# EAGLE design HeadphoneAmplifierUsingLM386 (EAGLE 9.6.2)
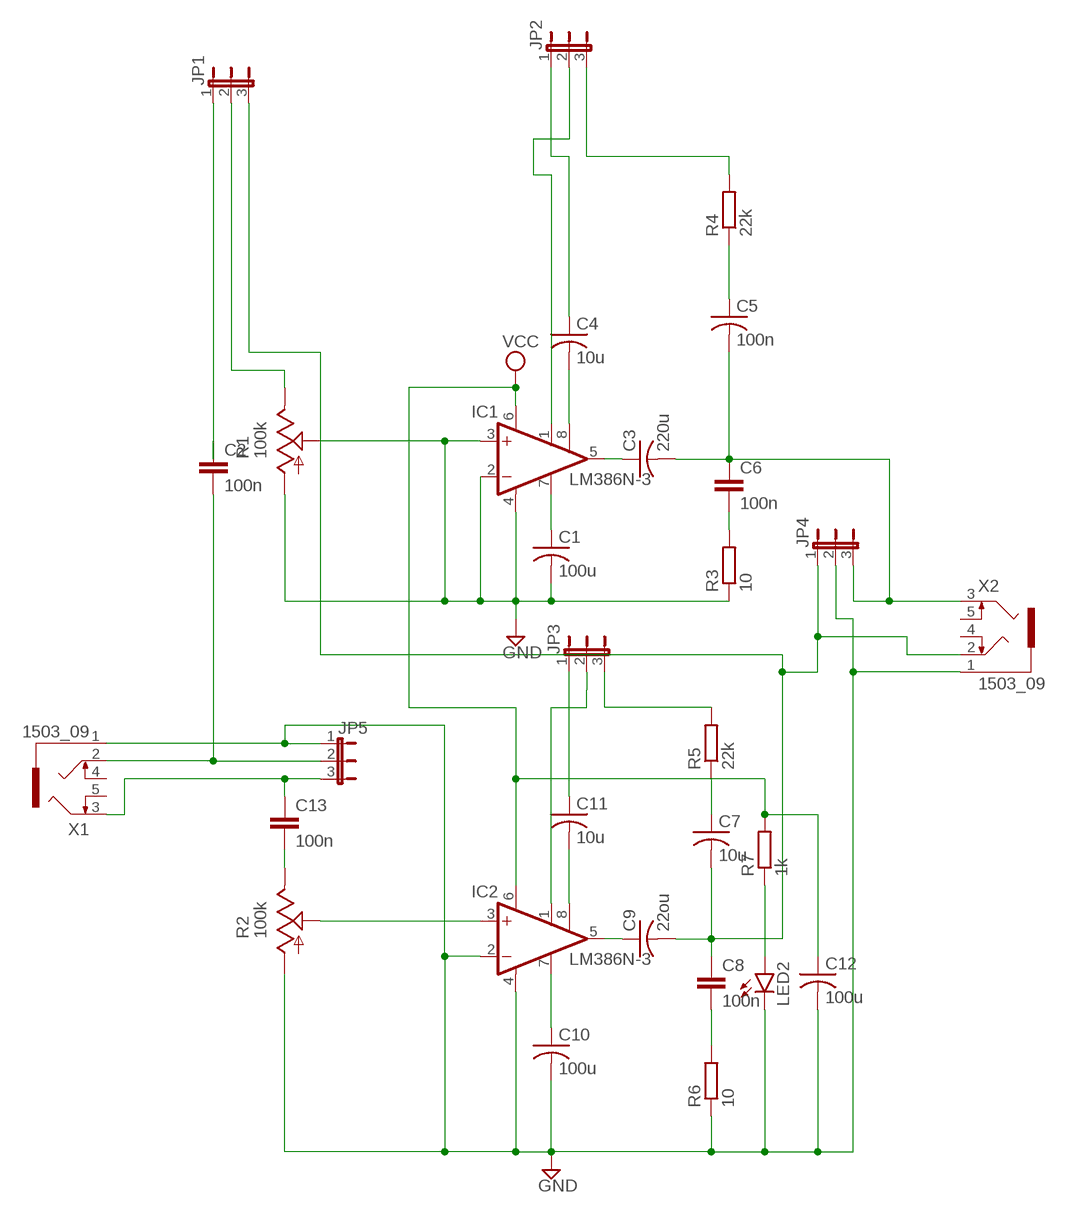
[diagram p0: schematic, sheet 1]

## Parts
C1  100u  C-US025-030X050  [C025-030X050]
C2  100n  C-EU025-030X050  [C025-030X050]
C3  220u  C-US025-030X050  [C025-030X050]
C4  10u  C-US025-030X050  [C025-030X050]
C5  100n  C-US025-030X050  [C025-030X050]
C6  100n  C-EU025-030X050  [C025-030X050]
C7  10u  C-US025-030X050  [C025-030X050]
C8  100n  C-EU025-030X050  [C025-030X050]
C9  22ou  C-US025-030X050  [C025-030X050]
C10  100u  C-US025-030X050  [C025-030X050]
C11  10u  C-US025-030X050  [C025-030X050]
C12  100u  C-US025-030X050  [C025-030X050]
C13  100n  C-EU025-030X050  [C025-030X050]
IC1  LM386N-3  [DIL08]
IC2  LM386N-3  [DIL08]
JP1  JP2E  [JP2]
JP2  JP2E  [JP2]
JP3  JP2E  [JP2]
JP4  JP2E  [JP2]
JP5  JP2E  [JP2]
LED2  LED3MM  [LED3MM]
R1  100k  TRIM_US-3223W  [3223W]
R2  100k  TRIM_US-3223W  [3223W]
R3  10  R-EU_0309/12  [0309/12]
R4  22k  R-EU_0309/12  [0309/12]
R5  22k  R-EU_0309/12  [0309/12]
R6  10  R-EU_0309/12  [0309/12]
R7  1k  R-EU_0309/12  [0309/12]
X1  1503_09  [1503_09]
X2  1503_09  [1503_09]

## Nets
GND: C1.2 C10.2 C12.2 IC1.2(-IN) IC1.3(+IN) IC1.4(GND) IC2.2(-IN) IC2.4(GND) JP4.2 JP5.1 LED2.K(C) R1.1(A) R1.2(S) R2.1(A) R3.1 R6.1 X1.1 X2.1
N$1: C2.1 JP1.1
N$2: C4.2 IC1.8(GAIN)
N$3: IC2.3(+IN) R2.2(S)
N$4: C1.1 IC1.7(BYPASS)
N$5: C3.1 IC1.5(OUT)
N$6: C3.2 C5.2 C6.1 JP4.3 X2.3
N$7: C2.2 JP5.2 X1.2
N$8: IC1.1(GAIN) JP2.2
N$9: C6.2 R3.2
N$10: C7.2 C8.1 C9.2 JP1.3 JP4.1 X2.2
N$11: C5.1 R4.1
N$12: C7.1 R5.1
N$13: JP2.3 R4.2
N$14: C8.2 R6.2
N$15: C10.1 IC2.7(BYPASS)
N$16: JP3.3 R5.2
N$17: C9.1 IC2.5(OUT)
N$18: C11.2 IC2.8(GAIN)
N$19: IC2.1(GAIN) JP3.2
N$20: C11.1 JP3.1
N$21: LED2.A R7.1
N$22: JP1.2 R1.3(E)
N$23: C13.2 R2.3(E)
N$24: C13.1 JP5.3 X1.3
N$25: C4.1 JP2.1
VCC: C12.1 IC1.6(VS) IC2.6(VS) R7.2
Unconnected: X1.4 X1.5 X2.4 X2.5

## Library data of the parts
C1 C3-C5 C7 C9-C12 = rcl:C-US: CAPACITOR, American symbol; SPICEPREFIX: C
C2 C6 C8 C13 = rcl:C-EU: CAPACITOR, European symbol; SPICEPREFIX: C
IC1 IC2 = linear:LM386?-*: Low Voltage Audio Power Amplifier Source: http://cache.national.com/ds/LM/LM386.pdf
JP1-JP5 = jumper:JP2E: JUMPER
LED2 = led:LED: LED OSRAM: - CHIPLED LG R971, LG N971, LY N971, LG Q971, LY Q971, LO R971, LY R971 LH N974, LH R974 LS Q976, LO Q976, LY Q976 LO Q996 - Hyper CHIPLED LW Q18S LB Q993, LB Q99A, LB R99A - SideLED LS A670, LO A670, LY A670, LG A670, LP A670 LB A673, LV A673, LT A673, LW A673 LH A674 LY A675 LS A676, LA A676, LO A676, LY A676, LW A676 LS A679, LY A679, LG A679 - Hyper Micro SIDELED® LS Y876, LA Y876, LO Y876, LY Y876 LT Y87S - SmartLED LW L88C, LW L88S LB L89C, LB L89S, LG L890 LS L89K, LO L89K, LY L89K LS L896, LA L896, LO L896, LY L896 - TOPLED LS T670, LO T670, LY T670, LG T670, LP T670 LSG T670, LSP T670, LSY T670, LOP T670, LYG T670 LG T671, LOG T671, LSG T671 LB T673, LV T673, LT T673, LW T673 LH T674 LS T676, LA T676, LO T676, LY T676, LB T676, LH T676, LSB T676, LW T676 LB T67C, LV T67C, LT T67C, LS T67K, LO T67K, LY T67K, LW E67C LS E67B, LA E67B, LO E67B, LY E67B, LB E67C, LV E67C, LT E67C LW T67C LS T679, LY T679, LG T679 LS T770, LO T770, LY T770, LG T770, LP T770 LB T773, LV T773, LT T773, LW T773 LH T774 LS E675, LA E675, LY E675, LS T675 LS T776, LA T776, LO T776, LY T776, LB T776 LHGB T686 LT T68C, LB T68C - Hyper Mini TOPLED® LB M676 - Mini TOPLED Santana® LG M470 LS M47K, LO M47K, LY M47K Source: http://www.osram.convergy.de LUXEON: - LUMILED® LXK2-PW12-R00, LXK2-PW12-S00, LXK2-PW14-U00, LXK2-PW14-V00 LXK2-PM12-R00, LXK2-PM12-S00, LXK2-PM14-U00 LXK2-PE12-Q00, LXK2-PE12-R00, LXK2-PE12-S00, LXK2-PE14-T00, LXK2-PE14-U00 LXK2-PB12-K00, LXK2-PB12-L00, LXK2-PB12-M00, LXK2-PB14-N00, LXK2-PB14-P00, LXK2-PB14-Q00 LXK2-PR12-L00, LXK2-PR12-M00, LXK2-PR14-Q00, LXK2-PR14-R00 LXK2-PD12-Q00, LXK2-PD12-R00, LXK2-PD12-S00 LXK2-PH12-R00, LXK2-PH12-S00 LXK2-PL12-P00, LXK2-PL12-Q00, LXK2-PL12-R00 Source: www.luxeon.com KINGBRIGHT: KA-3528ASYC Source: www.kingbright.com
R1 R2 = pot:TRIM_US-: POTENTIOMETER
R3-R7 = rcl:R-EU_: RESISTOR, European symbol; SPICEPREFIX: R
X1 X2 = con-lumberg:1503_09: Jack connectors according to JISC 6560, 3.5 mm Klinkeneinbaukupplung nach JISC 6560, 3,5 mm, 3-polig/ stereo, abgewinkelte Ausführung, mit 2 Öffnern und Lötaugen, für Leiterplatten Rückseitenmontage Source: http://www.lumberg.com/Produkte/PDFs/1503_09.pdf; OC_FARNELL: 1243244; OC_NEWARK: unknown

## Board
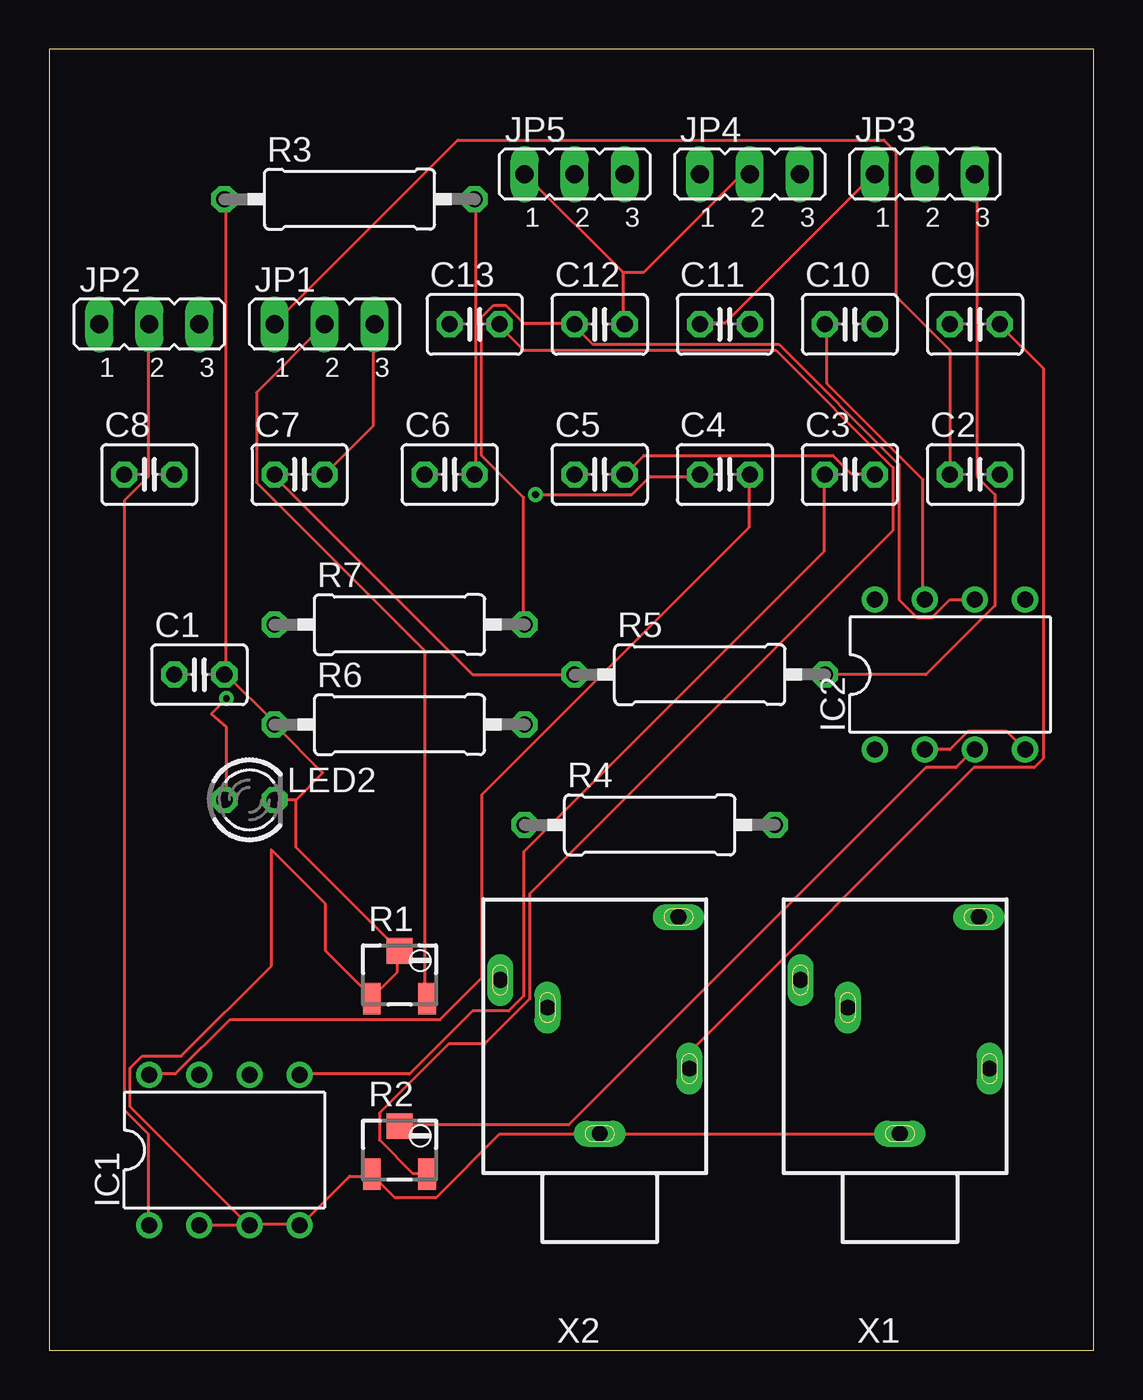
[diagram p1: board, top side]
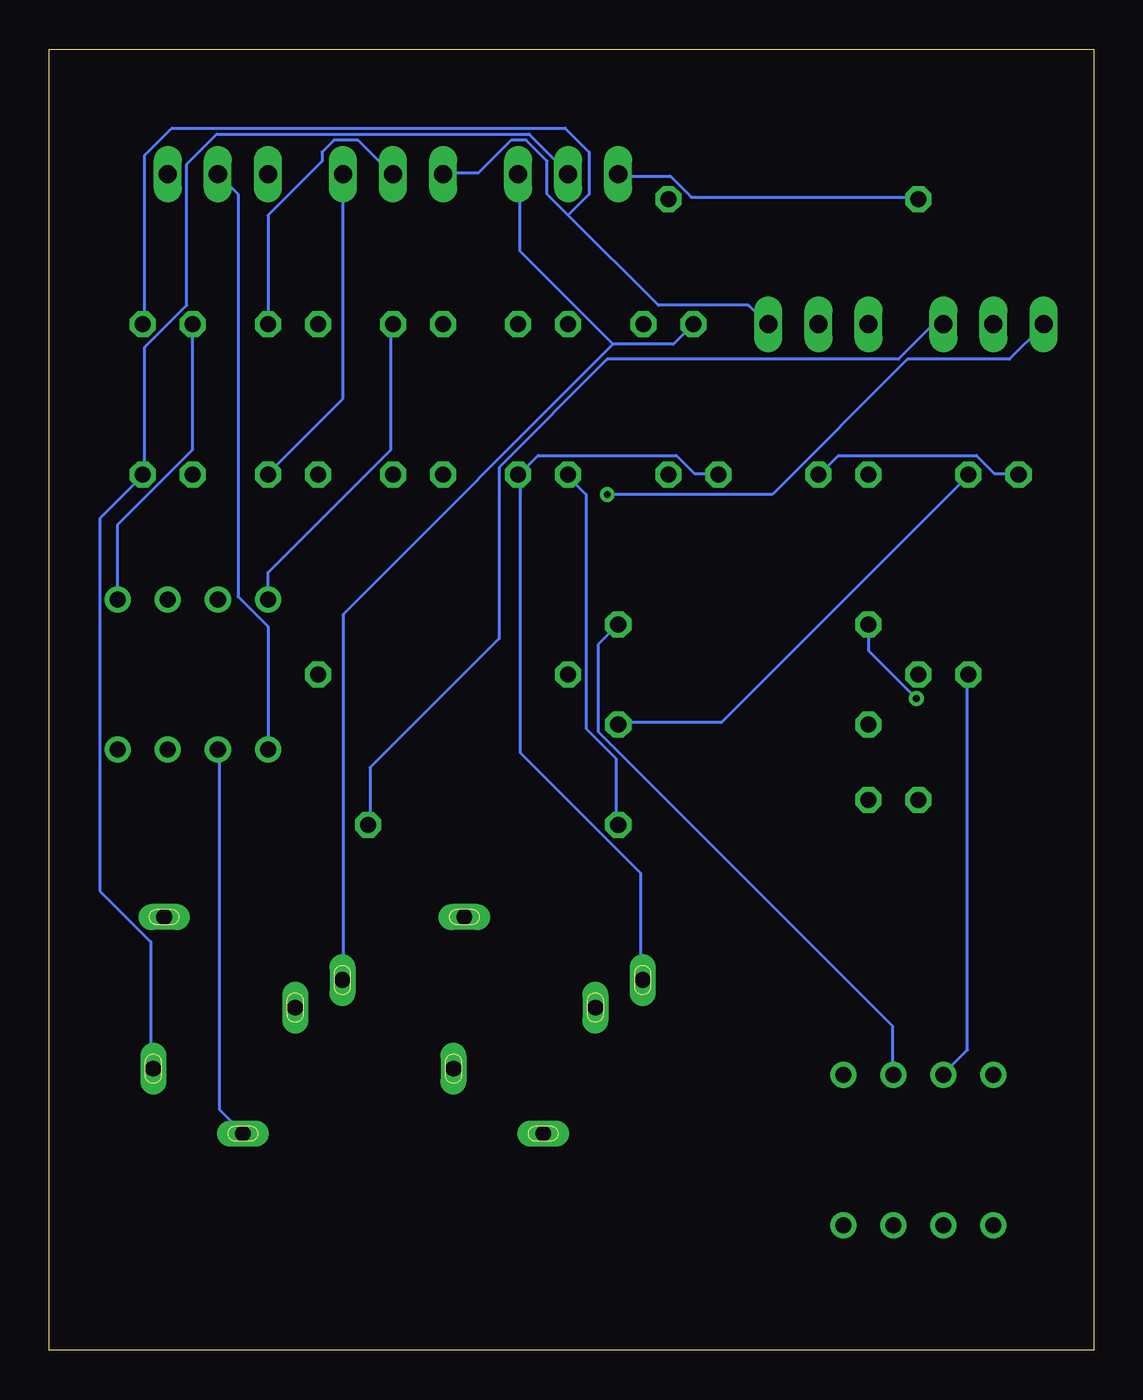
[diagram p2: board, bottom side, seen from below]

Size 53.01 x 66.03 mm. Coordinates in mm from the lower left corner, seen from the top.
Outline: 0,0 53.01,0 53.01,66.03 0,66.03 0,0
Copper layers (1*16): Top 0.035mm / dielectric 1.5mm / Bottom 0.035mm
Design rules "default": minimum track width 6mil, minimum drill 0.35mm, track to track 6mil, track to pad 6mil, pad to pad 6mil, via to via 6mil, smd to smd 6mil, copper to edge 40mil, drill to drill 6mil, minimum pad ring 10mil, minimum via ring 8mil, stop-mask expansion 4mil, vias tented up to drill 0mil, thermal gap 10mil

### Footprints (pad centres in the part's own frame; a part is rotated, then mirrored left to right if it is on the bottom)
C025-030X050 = drill 0.813 octagon: 1 -1.27,0; 2 1.27,0
DIL08 = drill 0.813 pad 1.27: 1 -3.81,-3.81; 2 -1.27,-3.81; 3 1.27,-3.81; 4 3.81,-3.81; 5 3.81,3.81; 6 1.27,3.81; 7 -1.27,3.81; 8 -3.81,3.81
JP2 = drill 0.914 long: 1 -2.54,0; 2 0,0; 3 2.54,0
LED3MM = drill 0.813 octagon: A -1.27,0; K 1.27,0
3223W = smd 0.9 x 1.6: 1 -1.4,-1.215; 3 1.4,-1.215 | smd 1.3 x 1.3: 2 0,1.215
0309/12 = drill 0.813 octagon: 1 -6.35,0; 2 6.35,0
1503_09 = drill 0.8 pad 1.2 long: 1 0,-2.1; 2 -4.55,-5.4; 3 5.05,-9.9; 4 -4,-13.1; 5 2.65,-8.5

### Placement (x,y rotation side)
C1  7.62,34.29 0 top
C2  46.99,44.45 0 top
C3  40.64,44.45 0 top
C4  34.29,44.45 0 top
C5  27.94,44.45 0 top
C6  20.32,44.45 0 top
C7  12.7,44.45 0 top
C8  5.08,44.45 0 top
C9  46.99,52.07 0 top
C10  40.64,52.07 0 top
C11  34.29,52.07 0 top
C12  27.94,52.07 0 top
C13  21.59,52.07 0 top
IC1  8.89,10.16 0 top
IC2  45.72,34.29 0 top
JP1  13.97,52.07 0 top
JP2  5.08,52.07 0 top
JP3  44.45,59.69 0 top
JP4  35.56,59.69 0 top
JP5  26.67,59.69 0 top
LED2  10.16,27.94 0 top
R1  17.78,19.05 0 top
R2  17.78,10.16 0 top
R3  15.24,58.42 0 top
R4  30.48,26.67 0 top
R5  33.02,34.29 0 top
R6  17.78,31.75 0 top
R7  17.78,36.83 0 top
X1  43.18,8.89 180 top
X2  27.94,8.89 180 top

### Tracks (layer width: path | path; a pad name or v marks a point on that pad's centre or on a via)
GND
  Top 0.152: 29.11,54.71 29.11,52.12 C12.2 | JP5.1 29.11,54.71 | 29.11,54.71 30.18,54.71 35.05,59.59 35.51,59.59 JP4.2 | 8.99,34.29 11.43,31.85 R6.1 13.88,29.3 12.52,27.94 | IC2.2 45.72,30.48 46.63,31.39 48.62,31.39 IC2.4 | X1.1 43.13,10.97 28.04,10.97 X2.1 27.89,10.97 22.86,10.97 19.66,7.77 17.53,7.77 16.46,8.84 R2.1 16.31,8.84 15.24,8.84 12.8,6.4 IC1.4 12.65,6.4 10.21,6.4 IC1.3 | IC1.3 10.06,6.4 4.12,12.34 4.12,14.33 4.72,14.94 6.71,14.94 11.28,19.51 11.28,25.4 14.02,22.66 14.02,20.27 16.31,17.98 R1.1 16.46,17.98 17.68,19.2 17.68,20.12 R1.2 12.52,25.52 12.52,27.94 | 8.99,34.29 8.99,58.37 R3.1 | 8.99,34.29 C1.2 | IC1.3 IC1.2 | 12.52,27.94 LED2.K
  Bottom 0.152: C10.2 41.91,57.61 39.17,60.35 39.17,60.81 38.56,61.42 37.34,61.42 35.66,59.74 JP4.2 | R3.1 8.99,58.52 20.42,58.52 21.49,59.59 24.08,59.59 JP5.1 | IC2.2 44.35,30.48 44.35,12.19 43.28,11.12 X1.1
N$1
  Top 0.152: C2.1 45.72,50.75 42.98,53.49 42.98,60.81 42.37,61.42 20.73,61.42 11.43,52.12 JP1.1
N$2
  Top 0.152: IC1.8 5.18,14.02 6.4,14.02 9.14,16.76 19.81,16.76 21.95,18.9 21.95,28.19 35.51,41.76 35.51,44.35 C4.2
N$3
  Top 0.152: R2.2 17.83,11.43 26.36,11.43 44.5,29.57 46.02,29.57 46.94,30.48 IC2.3
N$4
  Bottom 0.152: C1.1 6.4,34.29 6.4,15.24 7.62,14.02 IC1.7
N$5
  Top 0.152: IC1.5 12.8,14.02 18.29,14.02 21.49,17.22 23.32,17.22 24.08,17.98 24.08,25.3 39.32,40.54 39.32,44.35 C3.1
N$6
  Top 0.152: C5.2 30.18,45.41 39.78,45.41 40.69,44.5 41.91,44.5 C3.2
  Bottom 0.152: X2.3 23.01,18.9 23.01,24.23 29.11,30.33 29.11,44.35 C5.2 29.11,44.5 28.19,45.41 21.18,45.41 20.27,44.5 19.05,44.5 C6.1 | JP4.3 38.1,48.31 41.91,44.5 C3.2
N$7
  Bottom 0.152: X1.2 47.85,14.33 47.85,20.73 50.44,23.32 50.44,42.22 48.31,44.35 C2.2 48.16,44.5 48.16,50.9 46.02,53.03 46.02,60.2 44.5,61.72 28.65,61.72 26.67,59.74 JP5.2
N$8
  Top 0.152: IC1.1 5.03,6.4 5.03,10.97 3.81,12.19 3.81,43.13 5.03,44.35 5.03,51.97 JP2.2
N$9
  Top 0.152: C6.2 21.64,44.5 21.64,58.37 R3.2
N$10
  Top 0.152: C7.2 16.46,46.94 16.46,51.97 JP1.3 | X2.2 32.61,14.33 32.61,15.24 46.94,29.57 49.99,29.57 50.44,30.02 50.44,49.84 48.31,51.97 C9.2
  Bottom 0.152: C8.1 3.81,44.5 5.03,44.5 5.94,45.41 12.95,45.41 13.87,44.5 C7.2 | 26.67,57.61 22.1,53.03 17.53,53.03 16.61,52.12 JP1.3 | 26.67,57.61 27.74,58.67 27.74,60.35 28.8,61.42 29.57,61.42 31.24,59.74 32.92,59.74 JP4.1 | 26.67,57.61 25.6,58.67 25.6,60.81 26.82,62.03 46.79,62.03 48.16,60.66 48.16,52.12 C9.2
N$11
  Bottom 0.152: R4.1 24.23,26.67 24.23,30.02 25.76,31.55 25.76,43.43 26.67,44.35 C5.1
N$12
  Top 0.152: R5.1 21.49,34.29 11.43,44.35 C7.1
N$13
  Bottom 0.152: R4.2 36.73,26.67 36.73,29.57 30.18,36.12 30.18,44.81 24.69,50.29 9.91,50.29 8.23,51.97 7.62,51.97 JP2.3
N$14
  Bottom 0.152: R6.2 24.08,31.85 18.9,31.85 6.4,44.35 C8.2
N$15
  Top 0.152: C10.1 39.47,51.97 39.47,49.07 44.35,44.2 44.35,38.1 IC2.7
N$16
  Top 0.152: R5.2 44.5,34.29 48.01,37.8 48.01,43.43 47.09,44.35 47.09,59.59 JP3.3
N$17
  Bottom 0.152: C9.1 45.72,45.72 49.53,41.91 IC2.5
N$18
  Bottom 0.152: IC2.8 41.91,39.47 35.66,45.72 35.66,51.97 C11.2
N$19
  Bottom 0.152: IC2.1 41.91,36.73 43.43,38.25 43.43,58.67 JP3.2
N$20
  Top 0.152: C11.1 33.07,52.12 34.29,52.12 41.91,59.74 JP3.1
N$21  (via drill 0.35)
  Top 0.152: v8.99,33.07 8.22,32.3 8.98,31.62 8.98,28.03 LED2.A
  Bottom 0.152: v8.99,33.07 11.43,35.51 R7.1
N$22
  Top 0.152: JP1.2 10.52,48.62 10.52,44.04 19.05,35.51 19.05,17.98 R1.3
N$23
  Top 0.152: R2.3 19.05,8.99 18.44,8.99 16.76,10.67 16.76,12.04 20.27,15.54 22.1,15.54 24.38,17.83 24.38,23.16 42.82,41.6 42.82,44.81 36.88,50.75 24.08,50.75 22.86,51.97 C13.2
N$24
  Bottom 0.152: 24.38,51.05 38.1,37.34 38.1,18.9 X1.3 | 24.38,51.05 21.34,51.05 C13.1 | 24.38,51.05 29.11,55.78 29.11,59.59 JP5.3
N$25  (via drill 0.35)
  Top 0.152: v24.69,43.43 29.57,43.43 30.48,44.35 32.92,44.35 C4.1
  Bottom 0.152: v24.69,43.43 16.31,43.43 9.45,50.29 4.27,50.29 2.59,51.97 JP2.1
VCC
  Top 0.152: R7.2 24.08,36.88 24.08,43.28 21.95,45.41 21.95,52.43 22.55,53.03 23.16,53.03 24.08,52.12 26.67,52.12 C12.1 26.67,51.97 27.58,51.05 37.03,51.05 43.13,44.96 43.13,38.1 44.04,37.19 44.81,37.19 45.72,38.1 IC2.6
  Bottom 0.152: R7.2 25.15,35.81 25.15,31.39 10.21,16.46 10.21,14.02 IC1.6